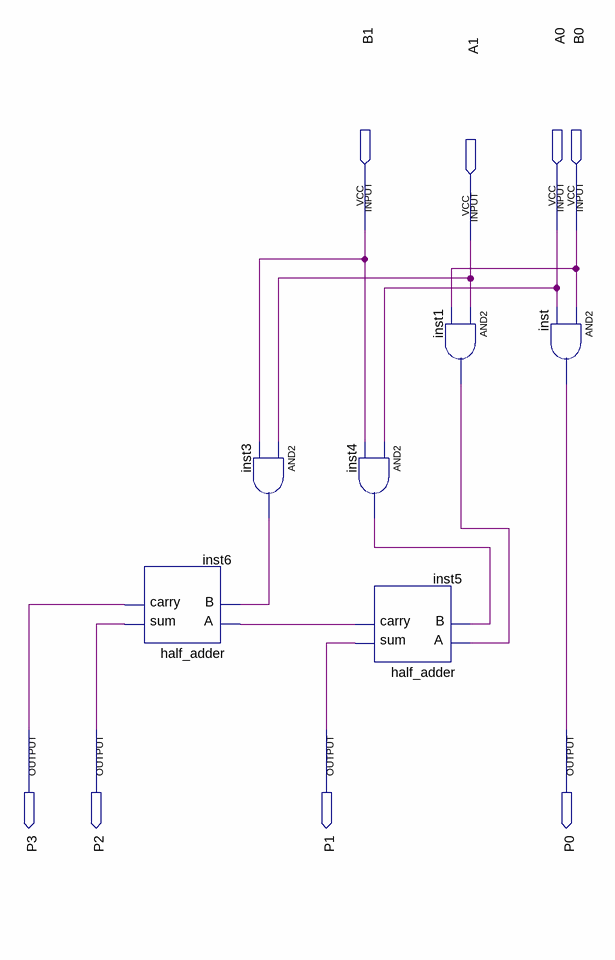
[diagram p0: schematic sheet]
// Quartus schematic 2 BIT MULTIPLIER.bdf as structural Verilog: 6 symbols, 8 pins
module \2_BIT_MULTIPLIER  (
  input  B1,
  input  A0,
  input  B0,
  input  A1,
  output P3,
  output P2,
  output P1,
  output P0
);

  wire inst1_out, inst3_out, inst4_out, inst5_carry;

  half_adder inst6 (.A(inst5_carry), .B(inst3_out), .sum(P2), .carry(P3));
  and inst3 (inst3_out, A1, B1);
  and inst4 (inst4_out, A0, B1);
  half_adder inst5 (.A(inst1_out), .B(inst4_out), .sum(P1), .carry(inst5_carry));
  and inst1 (inst1_out, A1, B0);
  and inst (P0, B0, A0);
endmodule
